# Altium project SAM_M8Q EVAL BOARD.PrjPcb
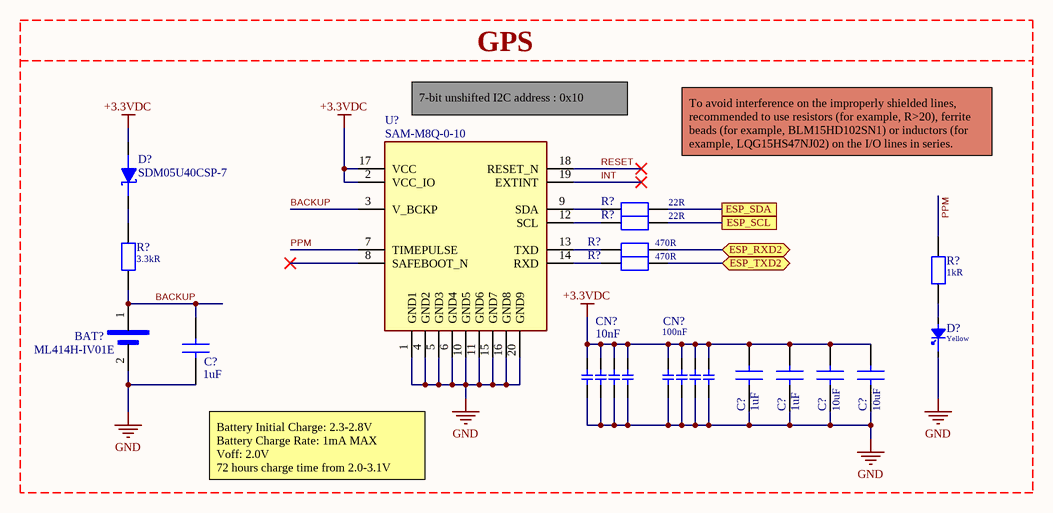
[diagram p0: Sheet1.SchDoc]
1 sheet, 17 parts. Net scope: flat (ports and power ports of the same name join across sheets).
Board file: PCB1.PcbDoc

## Sheet Sheet1.SchDoc
size A3; SheetNumber: 1; SheetTotal: 1

### Parts
(Parts that share a designator on the sheet are numbered #1, #2 ... from top to bottom, then left to right.)
BAT?  ML414H-IV01E  [ML414H-IV01E]
C?#1  Capacitance: 1uF  [CAP CER 0805]  (hidden comment: CL21B105KOFNFNE)
C?#2  Capacitance: 1uF  [CAP CER 0805]  (hidden comment: CL21B105KOFNFNE)
C?#3  Capacitance: 1uF  [CAP CER 0805]  (hidden comment: CL21B105KOFNFNE)
C?#4  Capacitance: 10uF  [CAP CER 0805]  (hidden comment: GRM21BR61E106MA73L)
C?#5  Capacitance: 10uF  [CAP CER 0805]  (hidden comment: GRM21BR61E106MA73L)
CN?#1  Capacitance: 10nF  [CAP NET 0612]  (hidden comment: CA064X103K1RACAUTO)
CN?#2  Capacitance: 100nF  [CAP NET 0612]  (hidden comment: CA064C104M4RAC7800)
D?#1  SDM05U40CSP-7  [SDM05U40CSP-7]
D?#2  Color: Yellow  [LED GR 0603]  (hidden comment: APTD1608LSYCK/J3-PF)
R?#1  Resistance: 22R  [RES 0603]  (hidden comment: RC1608F220CS)
R?#2  Resistance: 22R  [RES 0603]  (hidden comment: RC1608F220CS)
R?#3  Resistance: 470R  [RES 0603]  (hidden comment: RC0603FR-07470RL)
R?#4  Resistance: 470R  [RES 0603]  (hidden comment: RC0603FR-07470RL)
R?#5  Resistance: 3.3kR  [RES 0603]  (hidden comment: RC0603FR-073K3L)
R?#6  Resistance: 1kR  [RES 0603]  (hidden comment: RC0603FR-071KL)
U?  SAM-M8Q-0-10  [SAM-M8]

### Blocks framed on the sheet
GPS: BAT? C?#1-C?#5 CN?#1 CN?#2 D?#1 D?#2 R?#1-R?#6 U?

### Ports
ESP_RXD2 (bidir), ESP_SCL, ESP_SDA, ESP_TXD2 (bidir)

### Nets
+3.3VDC: C?#2.2 C?#3.2 C?#4.2 C?#5.2 CN?#1.5 CN?#1.6 CN?#1.7 CN?#1.8 CN?#2.5 CN?#2.6 CN?#2.7 CN?#2.8 D?#1.A U?.2(VCC_IO) U?.17(VCC)
GND: BAT?.2(NEG) C?#1.1 C?#2.1 C?#3.1 C?#4.1 C?#5.1 CN?#1.1 CN?#1.2 CN?#1.3 CN?#1.4 CN?#2.1 CN?#2.2 CN?#2.3 CN?#2.4 D?#2.1 U?.1(GND1) U?.4(GND2) U?.5(GND3) U?.6(GND4) U?.10(GND5) U?.11(GND6) U?.15(GND7) U?.16(GND8) U?.20(GND9)
BACKUP: BAT?.1(POS) C?#1.2 R?#5.1 U?.3(V_BCKP)
INT: U?.19(EXTINT)
PPM: R?#6.2 U?.7(TIMEPULSE)
RESET: U?.18(RESET_N)
NetD?#1_C: D?#1.C R?#5.2
NetD?#2_2: D?#2.2 R?#6.1
NetR?#1_1: R?#1.1 U?.9(SDA)
NetR?#1_2: R?#1.2 ; port ESP_SDA
NetR?#2_1: R?#2.1 U?.12(SCL)
NetR?#2_2: R?#2.2 ; port ESP_SCL
NetR?#3_1: R?#3.1 U?.13(TXD)
NetR?#3_2: R?#3.2 ; port ESP_RXD2
NetR?#4_1: R?#4.1 U?.14(RXD)
NetR?#4_2: R?#4.2 ; port ESP_TXD2

Not connected (* = marked no-connect by the designer): U? 8(SAFEBOOT_N)*

### Notes on the sheet
- 7-bit unshifted I2C address : 0x10
- To avoid interference on the improperly shielded lines, recommended to use resistors (for example, R>20), ferrite beads (for example, BLM15HD102SN1) or inductors (for example, LQG15HS47NJ02) on the I/O lines in series.
- Battery Initial Charge: 2.3-2.8V
  Battery Charge Rate: 1mA MAX
  Voff: 2.0V
  72 hours charge time from 2.0-3.1V

### Library data of the parts
BAT? = ML414H-IV01E: BATTERY LITHIUM 3V RECHARGE; Manufacturer: Seiko; Supplier 1: Mouser; Manufacturer Part Number: ML414H-IV01E; RoHS: Yes; Category: Batteries and Accessories; Stock 1: 5581; Pricing 1: 1=1.82000, 10=1.63000, 50=1.45000, 100=1.27000, 1000=0.96600, 10000=0.81500 (USD); Weight: 0.007; Termination: SMD/SMT; Package Quantity: 1; Voltage Rating: 3V; Packaging: Tape and Reel; ComponentLink1URL: https://datasheet.ciiva.com/3/ml414h-e-3633.pdf?src-supplier=Digi-Key; ComponentLink1Description: https://datasheet.ciiva.com/3/ml414h-e-3633.pdf?src-supplier=Digi-Key; ComponentLink2URL: https://datasheet.ciiva.com/3/ml414h-e-3634.pdf?src-supplier=Digi-Key; ComponentLink2Description: https://datasheet.ciiva.com/3/ml414h-e-3634.pdf?src-supplier=Digi-Key; Supplier Part Number 1: 628-ML414H-IV01E
C?#1-C?#3 = CAP CER 1UF 16V 0805: CAP CER 1UF 16V X7R 0805; Manufacturer: Samsung; Tolerance: 10%; Supplier 1: Digi-Key; Manufacturer Part Number: CL21B105KOFNFNE; RoHS: Yes; Category: Ceramic Capacitors; Stock 1: 73789; Pricing 1: 1=0.12000, 10=0.08900, 50=0.04840, 100=0.03940, 500=0.02818, 1000=0.02214 (USD); Mount: Surface Mount; Case/Package: 0805; Case Code (Metric): 2012; Case Code (Imperial): 0805; Contact Plating: Tin; Min Operating Temperature: -55°C; Max Operating Temperature: 125°C; Package Quantity: 1; Packaging: Tape and Reel; Voltage Rating: 16V; Dielectric: X7R; Termination: Wraparound; Series: CL; Construction: Flat; Length: 0.079inch; Width: 0.049inch; Thickness: 0.053inch; RoHS Compliant: Yes; ComponentLink1URL: https://datasheet.ciiva.com/25713/cl21b105kofnfne-25713075.pdf?src-supplier=Digi-Key; ComponentLink1Description: https://datasheet.ciiva.com/25713/cl21b105kofnfne-25713075.pdf?src-supplier=Digi-Key; Supplier Part Number 1: 1276-2930-1-ND
C?#4 C?#5 = CAP CER 10UF 25V 0805: MURATA - GRM21BR61E106MA73L - SMD Multilayer Ceramic Capacitor, 10 µF, 25 V, 0805 [2012 Metric], ± 20%, X5R, GRM Series; Voltage Rating: 25V; Supplier 1: Digi-Key; Manufacturer: Murata; Manufacturer Part Number: GRM21BR61E106MA73L; RoHS: Yes; Category: Ceramic Capacitors; Stock 1: 318119; Pricing 1: 1=0.26000, 10=0.17900, 50=0.11960, 100=0.10170, 500=0.07176, 1000=0.06279 (USD); Mount: Surface Mount; Case/Package: 0805; Case Code (Metric): 2012; Case Code (Imperial): 0805; Weight: 0.000335oz; Min Operating Temperature: -55°C; Max Operating Temperature: 85°C; Tolerance: 20%; Packaging: Tape and Reel; Dielectric: X5R; Termination: SMD/SMT; Resistor Type: Ceramic; Voltage Rating (DC): 25V; Package Quantity: 3000; Length: 2mm; Width: 0.049inch; Height: 1.25mm; Thickness: 0.055inch; Depth: 1.25mm; REACH SVHC: No SVHC; Lead Free: Lead Free; RoHS Compliant: Yes; ComponentLink1URL: http://www.farnell.com/datasheets/2079185.pdf?src-supplier=Farnell; ComponentLink1Description: http://www.farnell.com/datasheets/2079185.pdf?src-supplier=Farnell; ComponentLink2URL: http://www.mouser.com/ds/2/281/c02e-2905.pdf?src-supplier=Mouser; ComponentLink2Description: http://www.mouser.com/ds/2/281/c02e-2905.pdf?src-supplier=Mouser; ComponentLink3URL: http://components.arrow.com/part/dataview/0323_03061623?src-supplier=Arrow+Europe; ComponentLink3Description: http://components.arrow.com/part/dataview/0323_03061623?src-supplier=Arrow+Europe; ComponentLink4URL: https://search.murata.co.jp/Ceramy/image/img/A01X/G101/ENG/GRM21BR61E106MA73-01.pdf?src-supplier=Digi-Key; ComponentLink4Description: https://search.murata.co.jp/Ceramy/image/img/A01X/G101/ENG/GRM21BR61E106MA73-01.pdf?src-supplier=Digi-Key; ComponentLink5URL: http://www.farnell.com/datasheets/2079185.pdf?src-supplier=Element14; ComponentLink5Description: http://www.farnell.com/datasheets/2079185.pdf?src-supplier=Element14; Supplier Part Number 1: 490-10748-1-ND
CN?#1 = CAP NET CER 0.01UF 100V 0612: CAP ARRAY 10000PF 100V X7R 0612; Manufacturer: KEMET; Dielectric Material: Ceramic; Number of Capacitors: 4; Circuit Type: Isolated; Tolerance: 10%; Supplier 1: Digi-Key; Manufacturer Part Number: CA064X103K1RACAUTO; RoHS: Yes; Category: Capacitor Arrays; Stock 1: 32730; Pricing 1: 1=0.51000, 10=0.35400, 50=0.24800, 100=0.21250, 500=0.15940, 1000=0.13460 (USD); Mount: Surface Mount; Case/Package: 0612; Case Code (Metric): 1632; Case Code (Imperial): 0612; Min Operating Temperature: -55°C; Max Operating Temperature: 125°C; Packaging: Cut Tape; Voltage Rating: 100V; Number of Elements: 4; Voltage Rating (DC): 100V; Number of Circuits: 4; Length: 0.063inch; Width: 0.126inch; Height - Seated (Max): 0.035inch; Ratings: AEC-Q200; REACH SVHC: No SVHC; RoHS Compliant: Yes; ComponentLink1URL: http://www.farnell.com/datasheets/1996723.pdf?src-supplier=Farnell; ComponentLink1Description: http://www.farnell.com/datasheets/1996723.pdf?src-supplier=Farnell; ComponentLink2URL: http://www.farnell.com/datasheets/1996723.pdf?src-supplier=Element14; ComponentLink2Description: http://www.farnell.com/datasheets/1996723.pdf?src-supplier=Element14; ComponentLink3URL: http://www.kemet.com/docfinder?Partnumber=CA064X103K1RACAUTO&src-supplier=Digi-Key; ComponentLink3Description: http://www.kemet.com/docfinder?Partnumber=CA064X103K1RACAUTO&src-supplier=Digi-Key; ComponentLink4URL: https://api.kemet.com/component-edge/download/datasheet/CA064X103K1RACAUTO.pdf?src-supplier=Digi-Key; ComponentLink4Description: https://api.kemet.com/component-edge/download/datasheet/CA064X103K1RACAUTO.pdf?src-supplier=Digi-Key; Supplier Part Number 1: 399-12383-1-ND
CN?#2 = CAP NET CER 0.1UF 50V 0612: Cap Ceramic Array 0.1uF 16V X7R 10% 0612 SMD 4 Capacitor 125C Plastic T/R; Manufacturer: KEMET; Number of Terminals/Pins: 8; Number of Capacitors: 4; Circuit Type: Isolated; Tolerance: 20%; Supplier 1: Digi-Key; Manufacturer Part Number: CA064C104M4RAC7800; RoHS: Yes; Category: Uncategorized; Stock 1: 44013; Pricing 1: 1=0.40000, 10=0.27500, 50=0.19240, 100=0.16500, 500=0.12376, 1000=0.10450 (USD); Mount: Surface Mount; Case/Package: 0612; Case Code (Imperial): 0612; Dielectric Material: Ceramic; Case Code (Metric): 1632; Min Operating Temperature: -55°C; Max Operating Temperature: 125°C; Resistor Type: Ceramic; Dielectric: X7R; Package Quantity: 1; Voltage Rating: 16V; Packaging: Tape and Reel; Length: 0.063inch; Width: 0.126inch; Height - Seated (Max): 0.035inch; Depth: 3.2mm; Terminal Pitch: 0.8mm; ComponentLink1URL: https://media.digikey.com/pdf/Data%20Sheets/Kemet%20PDFs/X7R_Dielectric_10-200V_Rev_Nov2013.pdf?src-supplier=Digi-Key; ComponentLink1Description: https://media.digikey.com/pdf/Data%20Sheets/Kemet%20PDFs/X7R_Dielectric_10-200V_Rev_Nov2013.pdf?src-supplier=Digi-Key; ComponentLink2URL: http://components.arrow.com/part/dataview/0323_06931648?src-supplier=Arrow+Europe; ComponentLink2Description: http://components.arrow.com/part/dataview/0323_06931648?src-supplier=Arrow+Europe; ComponentLink3URL: http://www.kemet.com/docfinder?Partnumber=CA064C104M4RAC7800&src-supplier=Digi-Key; ComponentLink3Description: http://www.kemet.com/docfinder?Partnumber=CA064C104M4RAC7800&src-supplier=Digi-Key; Supplier Part Number 1: 399-10098-1-ND
D?#1 = Schottky Diode GPS: DIODE SCHTKY 40V 500MA X3WLB1006; Manufacturer: Diodes; Capacitance: 3.5E-11F; Element Configuration: Single; Forward Voltage: 460mV; Max Forward Surge Current (Ifsm): 14A; Max Reverse Current: 75uA; Supplier 1: Digi-Key; Manufacturer Part Number: SDM05U40CSP-7; RoHS: Yes; Category: Rectifier Diodes; Stock 1: 221856; Pricing 1: 1=0.41000, 10=0.30800, 100=0.17440, 500=0.11550, 1000=0.08855, 2000=0.07700 (USD); Mount: Surface Mount; Number of Pins: 2; Min Operating Temperature: -55°C; Max Operating Temperature: 150°C; Packaging: Tape and Reel; Reverse Voltage (DC): 40V; Average Rectified Current: 500mA; Forward Current: 500mA; Max Repetitive Reverse Voltage (Vrrm): 40V; Package Quantity: 5000; Max Reverse Voltage (DC): 40V; RoHS Compliant: Yes; ComponentLink1URL: http://www.mouser.com/ds/2/115/SDM05U40CSP-520315.pdf?src-supplier=Mouser; ComponentLink1Description: http://www.mouser.com/ds/2/115/SDM05U40CSP-520315.pdf?src-supplier=Mouser; ComponentLink2URL: https://www.diodes.com/assets/Datasheets/SDM05U40CSP.pdf?src-supplier=Digi-Key; ComponentLink2Description: https://www.diodes.com/assets/Datasheets/SDM05U40CSP.pdf?src-supplier=Digi-Key; Supplier Part Number 1: SDM05U40CSP-7DIDKR-ND; Weight: 0.4
D?#2 = LED YLW 0603: LED YELLOW CLEAR 2SMD; Manufacturer: Kingbright; Lens Color: Colorless; Luminous Intensity: 55mcd; Test Current: 2mA; Viewing Angle: 60°; Dominant Wavelength: 590nm; Forward Voltage: 1.85V; Supplier 1: Digi-Key; Manufacturer Part Number: APTD1608LSYCK/J3-PF; RoHS: Yes; Category: LEDs; Stock 1: 32340; Pricing 1: 1=0.58000, 10=0.38200, 100=0.25300, 1000=0.19532 (USD); Mount: Surface Mount; Case/Package: 0603; Case Code (Metric): 1608; Case Code (Imperial): 0603; Packaging: Tape and Reel; Lens Transparency: Clear; Length: 1.6mm; Width: 0.8mm; Height: 0.95mm; RoHS Compliant: No; ComponentLink1URL: http://www.mouser.com/ds/2/216/APTD1608LSYCK-J3-PF-535613.pdf?src-supplier=Mouser; ComponentLink1Description: http://www.mouser.com/ds/2/216/APTD1608LSYCK-J3-PF-535613.pdf?src-supplier=Mouser; ComponentLink2URL: http://www.kingbrightusa.com/images/catalog/SPEC/APTD1608LSYCK-J3-PF.pdf?src-supplier=Digi-Key; ComponentLink2Description: http://www.kingbrightusa.com/images/catalog/SPEC/APTD1608LSYCK-J3-PF.pdf?src-supplier=Digi-Key; Supplier Part Number 1: 754-1947-1-ND; Weight: 0.0025
R?#1 R?#2 = RES 22R 0603: Res Thick Film 0603 22 Ohm 1% 0.1W(1/10W) ±100ppm/C Molded SMD T/R; Manufacturer: Samsung; Temperature Coefficient: 100ppm/°C; Max Power Dissipation: 100mW; Voltage Rating (DC): 50V; Supplier 1: Digi-Key; Manufacturer Part Number: RC1608F220CS; RoHS: Yes; Category: Chip SMD Resistors; Stock 1: 185000; Pricing 1: 5000=0.01114 (USD); Case/Package: 0603; Contact Plating: Tin; Case Code (Metric): 1608; Case Code (Imperial): 0603; Min Operating Temperature: -55°C; Max Operating Temperature: 155°C; Tolerance: 1%; Resistor Type: Thick Film; Packaging: Tape and Reel; Package Quantity: 1; Number of Terminations: 2; Features: Moisture Resistant; Series: RC; Construction: Rectangular; Length: 0.063inch; Width: 0.031inch; Height: 0.022inch; Depth: 0.8mm; Radiation Hardening: No; Military Standard: Not; Lead Free: Lead Free; RoHS Compliant: Yes; ComponentLink1URL: http://components.arrow.com/part/dataview/0323_06012558?src-supplier=Arrow+Europe; ComponentLink1Description: http://components.arrow.com/part/dataview/0323_06012558?src-supplier=Arrow+Europe; ComponentLink2URL: http://components.arrow.com/part/dataview/51838512S5627638N4139?src-supplier=Arrow+Electronics; ComponentLink2Description: http://components.arrow.com/part/dataview/51838512S5627638N4139?src-supplier=Arrow+Electronics; ComponentLink3URL: https://sem.samsung.co.kr/servlet/DownloadServlet?dir=product/en/A070002&num=&fileName=Resistor-Precision1.pdf&src-supplier=Avnet; ComponentLink3Description: https://sem.samsung.co.kr/servlet/DownloadServlet?dir=product/en/A070002&num=&fileName=Resistor-Precision1.pdf&src-supplier=Avnet; ComponentLink4URL: http://www.samsungsem.com/kr/support/product-search/chip-resistor/RC1608F220CS.jsp?src-supplier=Digi-Key; ComponentLink4Description: http://www.samsungsem.com/kr/support/product-search/chip-resistor/RC1608F220CS.jsp?src-supplier=Digi-Key; ComponentLink5URL: https://sem.samsung.co.kr/servlet/DownloadServlet?dir=product/en/A070002&num=&fileName=Resistor-Precision1.pdf&src-supplier=Avnet+Europe; ComponentLink5Description: https://sem.samsung.co.kr/servlet/DownloadServlet?dir=product/en/A070002&num=&fileName=Resistor-Precision1.pdf&src-supplier=Avnet+Europe; Supplier Part Number 1: 1276-4511-2-ND; Weight: 0.002
R?#3 R?#4 = RES 470R 0603: YAGEO         RC0603FR-07470RL             SMD Chip Resistor, Thick Film, 470 ohm, 50 V, 0603 [1608 Metric], 100 mW,  1%, RC Series; Power Rating: 100mW; Voltage Rating: 50V; Temperature Coefficient: 100ppm/°C; Working Voltage: 75V; Supplier 1: Digi-Key; Manufacturer: Yageo; Manufacturer Part Number: RC0603FR-07470RL; RoHS: Yes; Category: Chip SMD Resistors; Stock 1: 785885; Pricing 1: 1=0.10000, 10=0.02400, 100=0.00970, 1000=0.00436, 2500=0.00378 (USD); Case/Package: 0603; Case Code (Metric): 1608; Case Code (Imperial): 0603; Min Operating Temperature: -55°C; Max Operating Temperature: 155°C; Tolerance: 1%; Packaging: Tape and Reel; Package Quantity: 1; Resistor Type: Thick Film; Number of Terminations: 2; Termination: SMD/SMT; Max Power Dissipation: 100mW; Features: Moisture Resistant; Series: RC; Technology: THICK FILM; Resistance Tolerance: 1%; Construction: Rectangular; Length: 1.6mm; Width: 0.031inch; Height: 0.022inch; Depth: 0.8mm; RoHS Compliant: Yes; REACH SVHC: No SVHC; Military Standard: Not; Lead Free: Lead Free; ComponentLink1URL: https://datasheet.ciiva.com/11808/0900766b80f96399-11808177.pdf?src-supplier=RSComponents; ComponentLink1Description: https://datasheet.ciiva.com/11808/0900766b80f96399-11808177.pdf?src-supplier=RSComponents; ComponentLink2URL: https://datasheet.ciiva.com/7746/1738695-7746359.pdf?src-supplier=Element14; ComponentLink2Description: https://datasheet.ciiva.com/7746/1738695-7746359.pdf?src-supplier=Element14; ComponentLink3URL: https://datasheet.ciiva.com/7746/1738695-7746360.pdf?src-supplier=Element14; ComponentLink3Description: https://datasheet.ciiva.com/7746/1738695-7746360.pdf?src-supplier=Element14; ComponentLink4URL: https://datasheet.ciiva.com/7660/1868787-7660793.pdf?src-supplier=Element14; ComponentLink4Description: https://datasheet.ciiva.com/7660/1868787-7660793.pdf?src-supplier=Element14; ComponentLink5URL: https://datasheet.ciiva.com/46440/1868787-46440907.pdf?src-supplier=Element14; ComponentLink5Description: https://datasheet.ciiva.com/46440/1868787-46440907.pdf?src-supplier=Element14; ComponentLink6URL: https://datasheet.ciiva.com/2454/pyu-r-int-thick-7-2454012.pdf?src-supplier=Digi-Key; ComponentLink6Description: https://datasheet.ciiva.com/2454/pyu-r-int-thick-7-2454012.pdf?src-supplier=Digi-Key; ComponentLink7URL: https://datasheet.ciiva.com/2454/pyu-r-int-thick-7-2454013.pdf?src-supplier=Digi-Key; ComponentLink7Description: https://datasheet.ciiva.com/2454/pyu-r-int-thick-7-2454013.pdf?src-supplier=Digi-Key; ComponentLink8URL: https://datasheet.ciiva.com/2454/pyu-r-int-thick-7-2454014.pdf?src-supplier=Digi-Key; ComponentLink8Description: https://datasheet.ciiva.com/2454/pyu-r-int-thick-7-2454014.pdf?src-supplier=Digi-Key; Supplier Part Number 1: 311-470HRCT-ND; Weight: 0.002
R?#5 = RES 3K3R 0603: YAGEO - RC0603FR-073K3L - SMD Chip Resistor, 0603 [1608 Metric], 3.3 kohm, RC Series, 75 V, Thick Film, 100 mW; Tolerance: 1%; Temperature Coefficient: 100ppm/°C; Voltage Rating (DC): 50V; Power Rating: 100mW; Supplier 1: Digi-Key; Manufacturer: Yageo; Manufacturer Part Number: RC0603FR-073K3L; RoHS: Yes; Category: Chip SMD Resistors; Stock 1: 789417; Pricing 1: 1=0.10000, 10=0.02400, 100=0.00970, 1000=0.00436, 2500=0.00378 (USD); Case/Package: 0603; Number of Pins: 2; Case Code (Imperial): 0603; Case Code (Metric): 1608; Size Code: 0603; Min Operating Temperature: -55°C; Max Operating Temperature: 155°C; Packaging: Tape and Reel; Resistor Type: Thick Film; Voltage Rating: 50V; Package Quantity: 1; Termination: SMD/SMT; Number of Terminations: 2; Max Power Dissipation: 100mW; Features: Moisture Resistant; Series: RC; Resistance Tolerance: 1%; Construction: Rectangular; Length: 1.6mm; Width: 0.8mm; Height: 0.022inch; Depth: 0.8mm; REACH SVHC: No SVHC; Lead Free: Lead Free; Military Standard: Not; RoHS Compliant: Yes; Supplier Part Number 1: 311-3.30KHRDKR-ND; Weight: 0.016
R?#6 = RES 1KR 0603: RES SMD 1K OHM 1% 1/10W 0603; Manufacturer: Yageo; Temperature Coefficient: 100ppm/°C; Power Rating: 100mW; Voltage Rating: 50V; Supplier 1: Digi-Key; Manufacturer Part Number: RC0603FR-071KL; RoHS: Yes; Category: Chip SMD Resistors; Stock 1: 12963545; Pricing 1: 1=0.10000, 10=0.02400, 100=0.00970, 1000=0.00436, 2500=0.00378 (USD); Case/Package: 0603; Contact Plating: Tin,Matte; Case Code (Imperial): 0603; Case Code (Metric): 1608; Size Code: 0603; Min Operating Temperature: -55°C; Max Operating Temperature: 155°C; Tolerance: 1%; Resistor Type: Thick Film; Packaging: Tape and Reel; Termination: SMD/SMT; Features: Moisture Resistant; Series: RC; Max Power Dissipation: 100mW; Number of Terminations: 2; Technology: THICK FILM; Resistance Tolerance: 1%; Construction: Rectangular; Length: 1.6mm; Height: 0.45mm; Depth: 0.8mm; Radiation Hardening: No; REACH SVHC: No SVHC; Lead Free: Lead Free; Military Standard: Not; RoHS Compliant: Yes; Supplier Part Number 1: 311-1.00KHRCT-ND; Weight: 0.016
U? = SAM-M8Q-0-10: Rf Rx Galileo 1.575GHZ/1.602GHZ; Manufacturer: u-blox; Interface: I2C,SPI,USB,UART; Sensitivity: -165dBm; Data Rate: 400Kbps; Supplier 1: Digi-Key; Manufacturer Part Number: SAM-M8Q-0-10; RoHS: Yes; Category: RF Receivers, Transceivers; Stock 1: 250; Pricing 1: 1=27.00000, 10=21.77000, 50=17.83000, 100=14.26010 (USD); Case/Package: SMD/SMT; Min Operating Temperature: -40°C; Max Operating Temperature: 85°C; Packaging: Tape and Reel; Frequency: 1.602GHz; ComponentLink1URL: https://www.u-blox.com/sites/default/files/SAM-M8Q_ProductSummary_%28UBX-15027452%29.pdf?src-supplier=Digi-Key; ComponentLink1Description: https://www.u-blox.com/sites/default/files/SAM-M8Q_ProductSummary_%28UBX-15027452%29.pdf?src-supplier=Digi-Key; ComponentLink2URL: https://www.u-blox.com/sites/default/files/SAM-M8Q_DataSheet_%28UBX-16012619%29.pdf?src-supplier=Digi-Key; ComponentLink2Description: https://www.u-blox.com/sites/default/files/SAM-M8Q_DataSheet_%28UBX-16012619%29.pdf?src-supplier=Digi-Key; Supplier Part Number 1: 672-1054-1-ND; Weight: 3.7